# Altium schematic sheet Sheet1-mcu.SchDoc
size A4; SheetNumber: 1; SheetTotal: 3
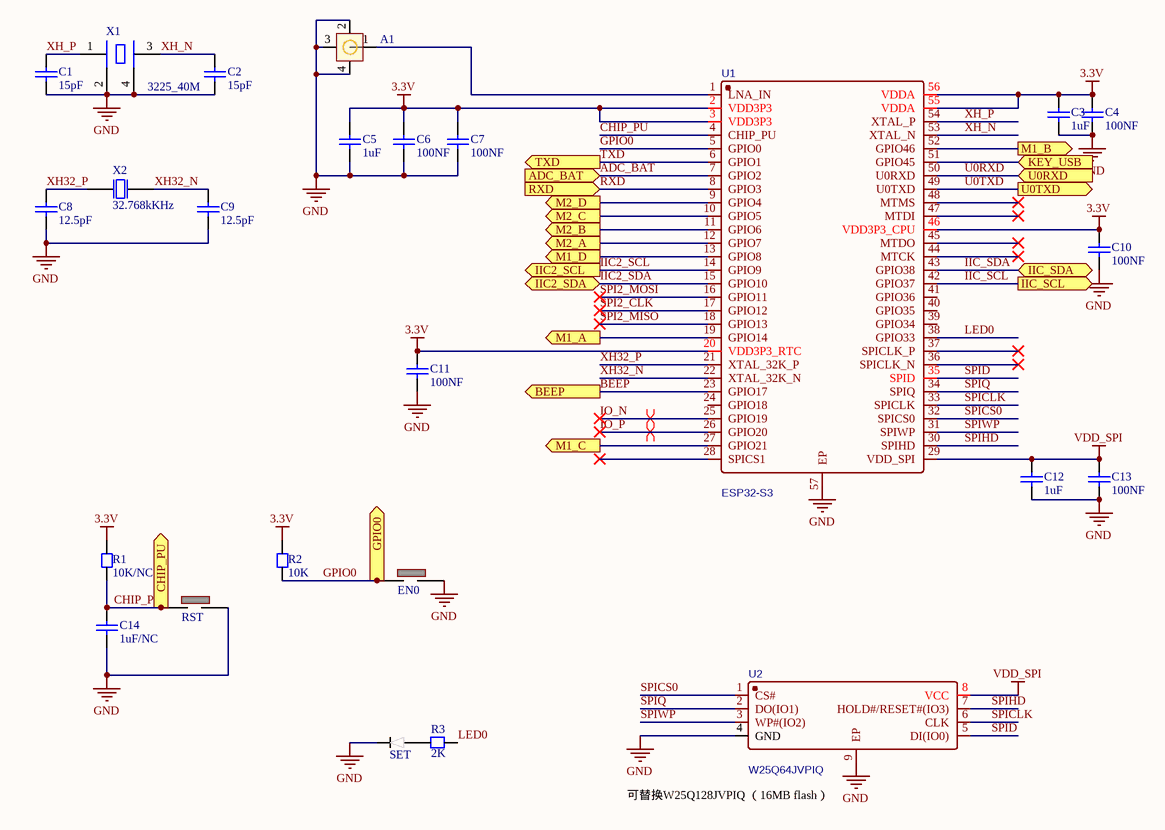
[diagram p0: Sheet1-mcu.SchDoc]

## Parts
A1  ANT-IPEX  [IPEX-SMD_HC-RF-IPEX0303-01]  (value not drawn)
C1  15pF  [CC1608-0603]
C2  15pF  [CC1608-0603]
C3  1uF  [CC1608-0603]
C4  100NF  [CC1608-0603]
C5  1uF  [CC1608-0603]
C6  100NF  [CC1608-0603]
C7  100NF  [CC1608-0603]
C8  12.5pF  [CC1608-0603]
C9  12.5pF  [CC1608-0603]
C10  100NF  [CC1608-0603]
C11  100NF  [CC1608-0603]
C12  1uF  [CC1608-0603]
C13  100NF  [CC1608-0603]
C14  1uF/NC  [CC1608-0603]
EN0  KEY 3*4  [KEY 3*4]  (value not drawn)
R1  10K/NC  [CR1608-0603]
R2  10K  [CR1608-0603]
R3  2K  [CR1608-0603]
RST  KEY 3*4  [KEY 3*4]  (value not drawn)
SET  LED 0603  [LED 0603]  (value not drawn)
U1  ESP32-S3  [QFN-56]
U2  W25Q64JVPIQ  [WSON-8]
X1  3225_40M  [XTAL-3225]
X2  32.768kKHz  [XTAL-3215]

## Ports
ADC_BAT (in), BEEP (out), CHIP_PU (out), GPIO0 (out), IIC2_SCL (out), IIC2_SDA (bidir), IIC_SCL (out), IIC_SDA (bidir), KEY_USB (in), M1_A (out), M1_B (out), M1_C (out), M1_D (out), M2_A (out), M2_B (out), M2_C (out), M2_D (out), RXD (in), TXD (out), U0RXD (in), U0TXD (out)

## Nets
3.3V: C3.2 C4.2 C5.2 C6.2 C7.2 C10.2 C11.2 R1.2 R2.2 U1.2(VDD3P3) U1.3(VDD3P3) U1.20(VDD3P3_RTC) U1.46(VDD3P3_CPU) U1.55(VDDA) U1.56(VDDA)
GND: A1.2 A1.3 A1.4 C1.1 C2.1 C3.1 C4.1 C5.1 C6.1 C7.1 C8.1 C9.1 C10.1 C11.1 C12.1 C13.1 C14.1 EN0.2 RST.2 SET.2 U1.57(EP) U2.4(GND) U2.9(EP) X1.2(GND) X1.4(GND)
VDD_SPI: C12.2 C13.2 U1.29(VDD_SPI) U2.8(VCC)
ADC_BAT: U1.7(GPIO2) ; port ADC_BAT
BEEP: U1.23(GPIO17) ; port BEEP
CHIP_PU: C14.2 R1.1 RST.1 U1.4(CHIP_PU) ; port CHIP_PU
GPIO0: EN0.1 R2.1 U1.5(GPIO0) ; port GPIO0
IIC2_SCL: U1.14(GPIO9) ; port IIC2_SCL
IIC2_SDA: U1.15(GPIO10) ; port IIC2_SDA
IIC_SCL: U1.42(GPIO37) ; port IIC_SCL
IIC_SDA: U1.43(GPIO38) ; port IIC_SDA
IO_N: U1.25(GPIO19)
IO_P: U1.26(GPIO20)
KEY_USB: U1.51(GPIO45) ; port KEY_USB
LED0: R3.1 U1.38(GPIO33)
M1_A: U1.19(GPIO14) ; port M1_A
M1_B: U1.52(GPIO46) ; port M1_B
M1_C: U1.27(GPIO21) ; port M1_C
M1_D: U1.13(GPIO8) ; port M1_D
M2_A: U1.12(GPIO7) ; port M2_A
M2_B: U1.11(GPIO6) ; port M2_B
M2_C: U1.10(GPIO5) ; port M2_C
M2_D: U1.9(GPIO4) ; port M2_D
RXD: U1.8(GPIO3) ; port RXD
SPI2_CLK: U1.17(GPIO12)
SPI2_MISO: U1.18(GPIO13)
SPI2_MOSI: U1.16(GPIO11)
SPICLK: U1.33(SPICLK) U2.6(CLK)
SPICS0: U1.32(SPICS0) U2.1(CS#)
SPID: U1.35(SPID) U2.5(DI(IO0))
SPIHD: U1.30(SPIHD) U2.7(HOLD#/RESET#(IO3))
SPIQ: U1.34(SPIQ) U2.2(DO(IO1))
SPIWP: U1.31(SPIWP) U2.3(WP#(IO2))
TXD: U1.6(GPIO1) ; port TXD
U0RXD: U1.50(U0RXD) ; port U0RXD
U0TXD: U1.49(U0TXD) ; port U0TXD
XH32_N: C9.2 U1.22(XTAL_32K_N) X2.2(OSC2)
XH32_P: C8.2 U1.21(XTAL_32K_P) X2.1(OSC1)
XH_N: C2.2 U1.53(XTAL_N) X1.3(OSC2)
XH_P: C1.2 U1.54(XTAL_P) X1.1(OSC1)
NetA1_1: A1.1 U1.1(LNA_IN)
NetR3_2: R3.2 SET.1

Not connected (* = marked no-connect by the designer): U1 24(GPIO18) 28(SPICS1)* 36(SPICLK_N)* 37(SPICLK_P)* 39(GPIO34) 40(GPIO35) 41(GPIO36) 44(MTCK)* 45(MTDO)* 47(MTDI)* 48(MTMS)*

## Layout directives
differential pair: IO_N, IO_P

## Notes on the sheet
- (near U2) 可替换W25Q128JVPIQ （16MB flash）

## Library data of the parts
A1 = ANT-IPEX: 贴片封装的天线 封装类型为IPEX
C1-C14 = Cap Chip 0603: 0603封装的电容; Published: 8-Jun-2000; Revision: July-2002: Re-released for DXP Platform.; Publisher: Altium Limited
EN0 RST = KEY 3*4: 轻触开关按键
R1-R3 = Resistor Chip 0603: 0603封装电阻; Published: 8-Jun-2000; Revision: July-2002: Re-released for DXP Platform.; Publisher: Altium Limited
U1 = ESP32-S3: Manufacturer: ESPRESSIF(乐鑫); Contributor: LCSC; Supplier: LCSC; Supplier Part: C2913192; Manufacturer Part: ESP32-S3; JLCPCB Part Class: Extended Part; spicePre: U; spiceSymbolName: ESP32-S3
U2 = W25Q128JVPIQ: Manufacturer: WINBOND(华邦); Contributor: LCSC; Supplier: LCSC; Supplier Part: C2803379; Manufacturer Part: W25Q128JVPIQ; JLCPCB Part Class: Extended Part; spicePre: U; spiceSymbolName: W25Q128JVPIQ
X1 = XTAL 3225: 3225封装的晶振
X2 = XTAL 3215 32.768kKHz: 3215封装的时钟晶振